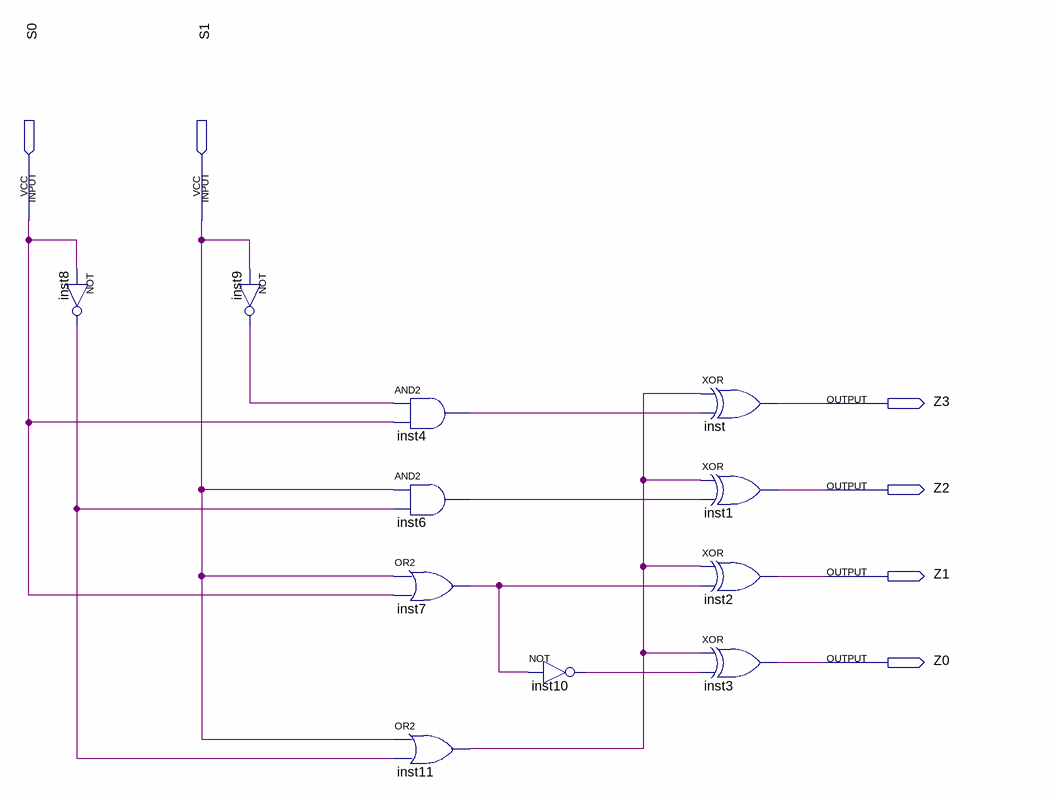
[diagram p0: schematic sheet]
// Quartus schematic BLOQUEZ.bdf as structural Verilog: 11 symbols, 6 pins
module BLOQUEZ (
  input  S0,
  input  S1,
  output Z3,
  output Z2,
  output Z1,
  output Z0
);

  wire inst4_out, inst6_out, inst7_out, inst8_out, inst9_out, inst10_out, inst11_out;

  not inst8 (inst8_out, S0);
  not inst9 (inst9_out, S1);
  and inst4 (inst4_out, inst9_out, S0);
  and inst6 (inst6_out, S1, inst8_out);
  or inst7 (inst7_out, S1, S0);
  or inst11 (inst11_out, S1, inst8_out);
  not inst10 (inst10_out, inst7_out);
  xor inst (Z3, inst11_out, inst4_out);
  xor inst1 (Z2, inst11_out, inst6_out);
  xor inst2 (Z1, inst11_out, inst7_out);
  xor inst3 (Z0, inst11_out, inst10_out);
endmodule
